# EAGLE design M507A (EAGLE 6.6.0)
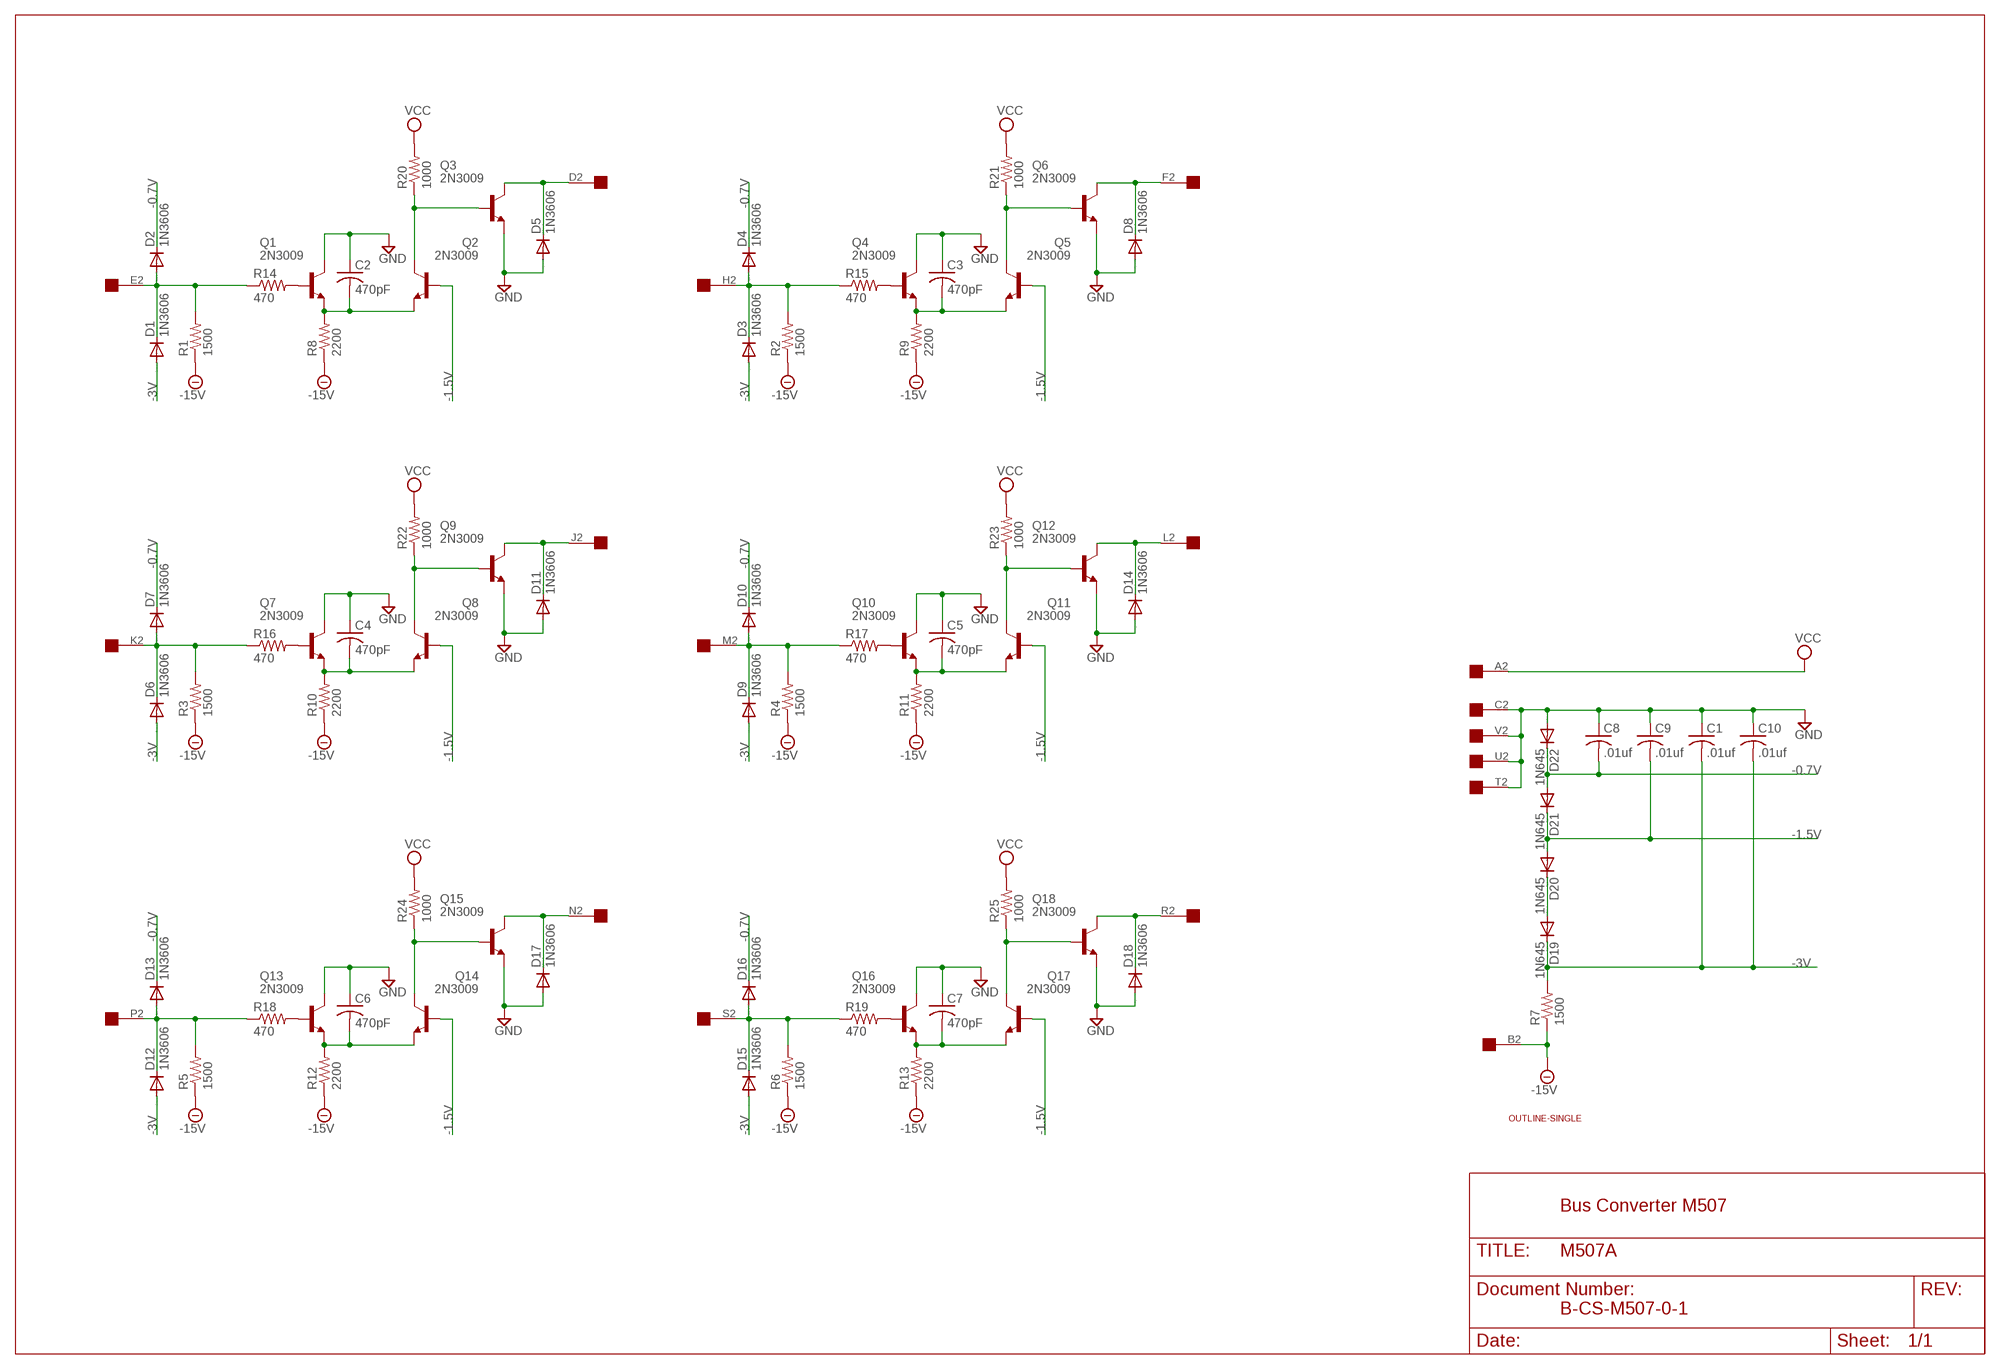
[diagram p0: schematic, sheet 1]

## Parts
C1  .01uf  C-US050-025X075  [C050-025X075]
C2  470pF  C-US050-025X075  [C050-025X075]
C3  470pF  C-US050-025X075  [C050-025X075]
C4  470pF  C-US050-025X075  [C050-025X075]
C5  470pF  C-US050-025X075  [C050-025X075]
C6  470pF  C-US050-025X075  [C050-025X075]
C7  470pF  C-US050-025X075  [C050-025X075]
C8  .01uf  C-US050-025X075  [C050-025X075]
C9  .01uf  C-US050-025X075  [C050-025X075]
C10  .01uf  C-US050-025X075  [C050-025X075]
D1  1N3606  1N4148DO35-10  [DO35-10]
D2  1N3606  1N4148DO35-10  [DO35-10]
D3  1N3606  1N4148DO35-10  [DO35-10]
D4  1N3606  1N4148DO35-10  [DO35-10]
D5  1N3606  1N4148DO35-10  [DO35-10]
D6  1N3606  1N4148DO35-10  [DO35-10]
D7  1N3606  1N4148DO35-10  [DO35-10]
D8  1N3606  1N4148DO35-10  [DO35-10]
D9  1N3606  1N4148DO35-10  [DO35-10]
D10  1N3606  1N4148DO35-10  [DO35-10]
D11  1N3606  1N4148DO35-10  [DO35-10]
D12  1N3606  1N4148DO35-10  [DO35-10]
D13  1N3606  1N4148DO35-10  [DO35-10]
D14  1N3606  1N4148DO35-10  [DO35-10]
D15  1N3606  1N4148DO35-10  [DO35-10]
D16  1N3606  1N4148DO35-10  [DO35-10]
D17  1N3606  1N4148DO35-10  [DO35-10]
D18  1N3606  1N4148DO35-10  [DO35-10]
D19  1N645  1N4148DO35-10  [DO35-10]
D20  1N645  1N4148DO35-10  [DO35-10]
D21  1N645  1N4148DO35-10  [DO35-10]
D22  1N645  1N4148DO35-10  [DO35-10]
Q1  2N3009  2N3019  [TO39]
Q2  2N3009  2N3019  [TO39]
Q3  2N3009  2N3019  [TO39]
Q4  2N3009  2N3019  [TO39]
Q5  2N3009  2N3019  [TO39]
Q6  2N3009  2N3019  [TO39]
Q7  2N3009  2N3019  [TO39]
Q8  2N3009  2N3019  [TO39]
Q9  2N3009  2N3019  [TO39]
Q10  2N3009  2N3019  [TO39]
Q11  2N3009  2N3019  [TO39]
Q12  2N3009  2N3019  [TO39]
Q13  2N3009  2N3019  [TO39]
Q14  2N3009  2N3019  [TO39]
Q15  2N3009  2N3019  [TO39]
Q16  2N3009  2N3019  [TO39]
Q17  2N3009  2N3019  [TO39]
Q18  2N3009  2N3019  [TO39]
R1  1500  R-US_0207/10  [0207/10]
R2  1500  R-US_0207/10  [0207/10]
R3  1500  R-US_0207/10  [0207/10]
R4  1500  R-US_0207/10  [0207/10]
R5  1500  R-US_0207/10  [0207/10]
R6  1500  R-US_0207/10  [0207/10]
R7  1500  R-US_0207/10  [0207/10]
R8  2200  R-US_0207/10  [0207/10]
R9  2200  R-US_0207/10  [0207/10]
R10  2200  R-US_0207/10  [0207/10]
R11  2200  R-US_0207/10  [0207/10]
R12  2200  R-US_0207/10  [0207/10]
R13  2200  R-US_0207/10  [0207/10]
R14  470  R-US_0207/10  [0207/10]
R15  470  R-US_0207/10  [0207/10]
R16  470  R-US_0207/10  [0207/10]
R17  470  R-US_0207/10  [0207/10]
R18  470  R-US_0207/10  [0207/10]
R19  470  R-US_0207/10  [0207/10]
R20  1000  R-US_0207/10  [0207/10]
R21  1000  R-US_0207/10  [0207/10]
R22  1000  R-US_0207/10  [0207/10]
R23  1000  R-US_0207/10  [0207/10]
R24  1000  R-US_0207/10  [0207/10]
R25  1000  R-US_0207/10  [0207/10]
U$3  EDGE-1  [EDGE-CON1]
U$4  OUTLINE-SINGLE  [SINGLE]

## Nets
-0.7V [Supply]: C8.2 D2.C D4.C D7.C D10.C D13.C D16.C D21.A D22.C
-1.5V [Supply]: C9.2 D20.A D21.C Q2.2(B) Q5.2(B) Q8.2(B) Q11.2(B) Q14.2(B) Q17.2(B)
-3V [Supply]: C1.2 C10.2 D1.A D3.A D6.A D9.A D12.A D15.A D19.C R7.2
-15V [Supply]: R1.1 R2.1 R3.1 R4.1 R5.1 R6.1 R7.1 R8.1 R9.1 R10.1 R11.1 R12.1 R13.1 U$3.B2
GND [Supply]: C1.1 C2.1 C3.1 C4.1 C5.1 C6.1 C7.1 C8.1 C9.1 C10.1 D5.A D8.A D11.A D14.A D17.A D18.A D22.A Q1.3(C) Q3.1(E) Q4.3(C) Q6.1(E) Q7.3(C) Q9.1(E) Q10.3(C) Q12.1(E) Q13.3(C) Q15.1(E) Q16.3(C) Q18.1(E) U$3.C2 U$3.T2 U$3.U2 U$3.V2
N$1: D1.C D2.A R1.2 R14.1 U$3.E2
N$2: Q1.2(B) R14.2
N$3: C2.2 Q1.1(E) Q2.1(E) R8.2
N$4: D3.C D4.A R2.2 R15.1 U$3.H2
N$5: Q2.3(C) Q3.2(B) R20.1
N$6: D5.C Q3.3(C) U$3.D2
N$7: Q4.2(B) R15.2
N$8: C3.2 Q4.1(E) Q5.1(E) R9.2
N$9: Q5.3(C) Q6.2(B) R21.1
N$10: D8.C Q6.3(C) U$3.F2
N$11: D6.C D7.A R3.2 R16.1 U$3.K2
N$12: Q7.2(B) R16.2
N$14: C4.2 Q7.1(E) Q8.1(E) R10.2
N$15: Q8.3(C) Q9.2(B) R22.1
N$16: D11.C Q9.3(C) U$3.J2
N$17: D9.C D10.A R4.2 R17.1 U$3.M2
N$18: Q10.2(B) R17.2
N$19: C5.2 Q10.1(E) Q11.1(E) R11.2
N$20: Q11.3(C) Q12.2(B) R23.1
N$21: D14.C Q12.3(C) U$3.L2
N$22: D12.C D13.A R5.2 R18.1 U$3.P2
N$23: Q13.2(B) R18.2
N$24: C6.2 Q13.1(E) Q14.1(E) R12.2
N$25: Q14.3(C) Q15.2(B) R24.1
N$26: D17.C Q15.3(C) U$3.N2
N$27: D15.C D16.A R6.2 R19.1 U$3.S2
N$28: Q16.2(B) R19.2
N$29: C7.2 Q16.1(E) Q17.1(E) R13.2
N$30: Q17.3(C) Q18.2(B) R25.1
N$31: D18.C Q18.3(C) U$3.R2
N$51 [Supply]: D19.A D20.C
VCC [Supply]: R20.2 R21.2 R22.2 R23.2 R24.2 R25.2 U$3.A2

## Notes on the sheet
- Bus Converter M507
- B-CS-M507-0-1

## Library data of the parts
C1-C10 = rcl:C-US: CAPACITOR, American symbol
D1-D22 = diode:1N4148: DIODE high speed (Philips)
Q1-Q18 = transistor-npn:2N3019: NPN Transistor
R1-R25 = rcl:R-US_: RESISTOR, American symbol
U$3 = dec-con:EDGE-1: Single-Sided DEC Edge Connector -- (side 2)
U$4 = dec-con:OUTLINE-*: Board outlines for DEC boards.

## Net classes
1 Supply: width 0.813 mm

## Board
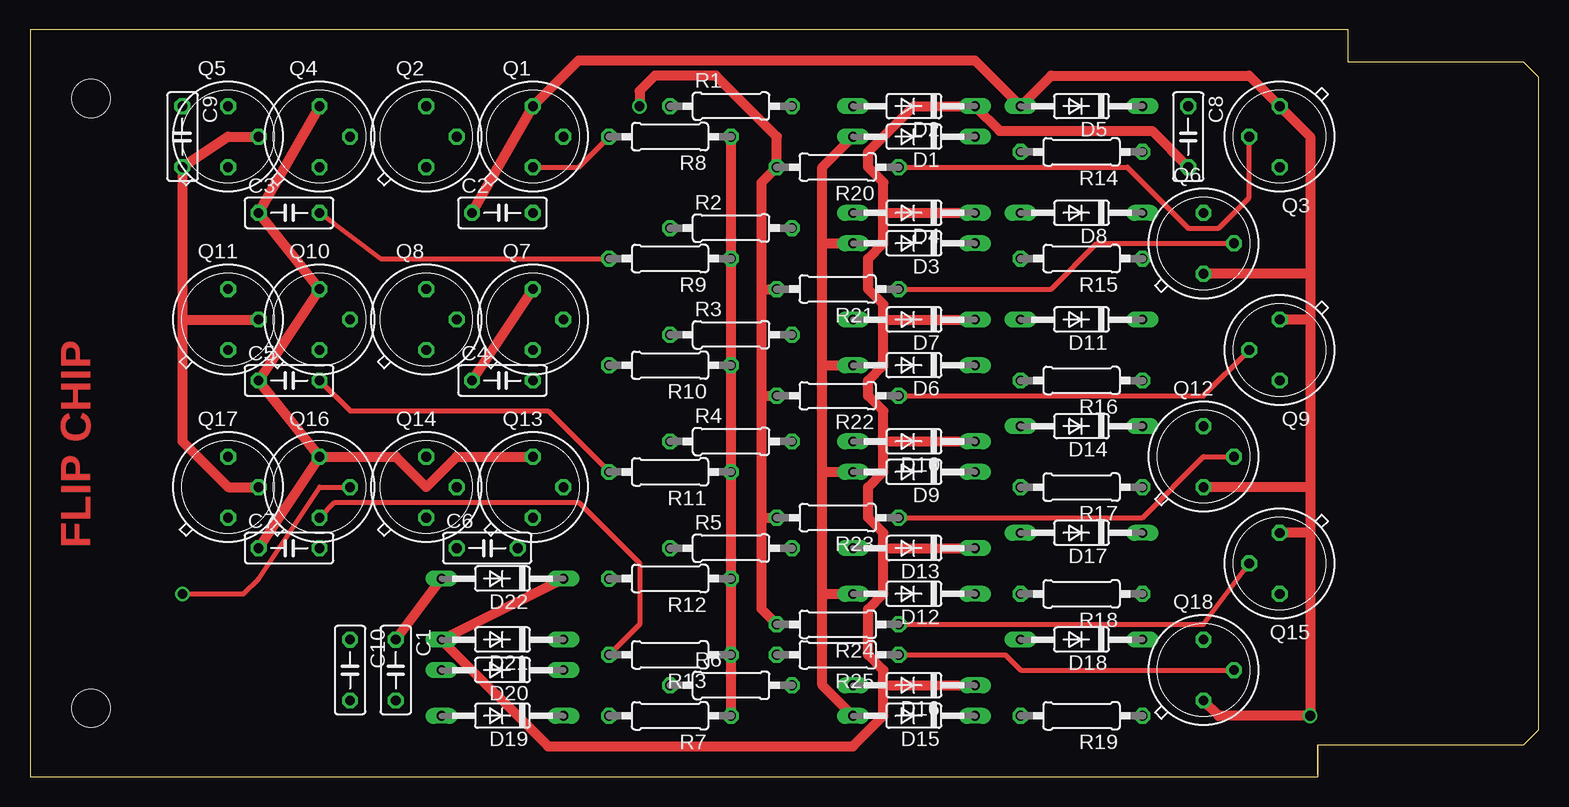
[diagram p1: board, top side]
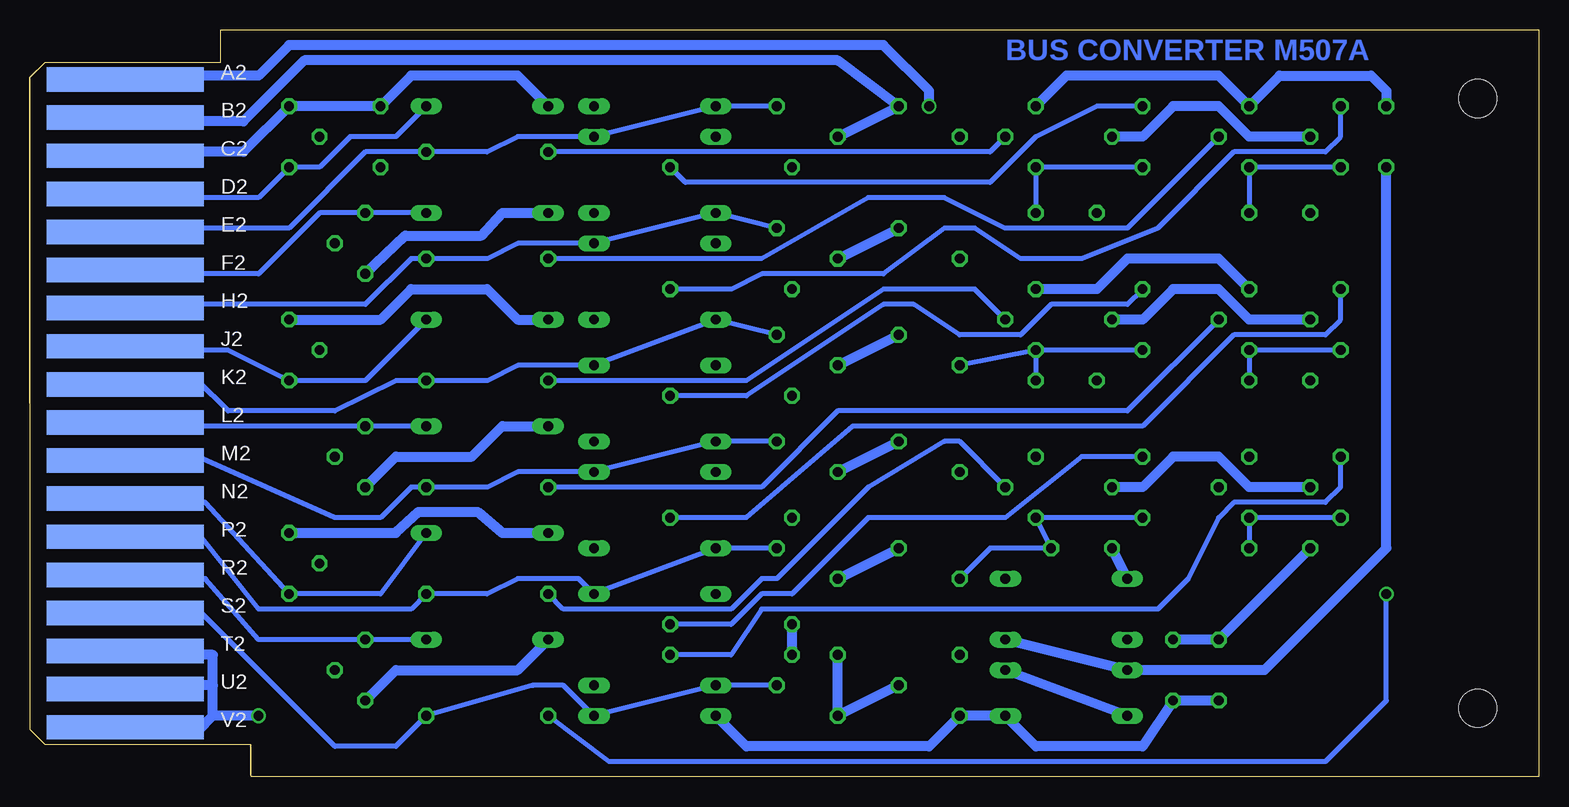
[diagram p2: board, bottom side, seen from below]

Size 125.73 x 62.23 mm. Coordinates in mm from the lower left corner, seen from the top.
Copper layers (1+16): Top 0.035mm / dielectric 1.5mm / Bottom 0.035mm
Design rules "16mils": minimum track width 16mil, minimum drill 32mil, track to track 15mil, track to pad 10mil, pad to pad 10mil, via to via 10mil, smd to smd 10mil, copper to edge 13mil, drill to drill 10mil, minimum pad ring 10mil, minimum via ring 8mil, stop-mask expansion 0mil, vias tented up to drill 0mil, thermal gap 10mil

### Footprints (pad centres in the part's own frame; a part is rotated, then mirrored left to right if it is on the bottom)
C050-025X075 = drill 0.813 octagon: 1 -2.54,0; 2 2.54,0
DO35-10 = drill 0.813 long: A 5.08,0; C -5.08,0
TO39 = drill 0.813 octagon: 1 0,-2.54; 2 2.54,0; 3 0,2.54
0207/10 = drill 0.813 octagon: 1 -5.08,0; 2 5.08,0
EDGE-CON1 = smd 13.106 x 2.032 bottom: A2 7.938,4.128; B2 7.938,7.303; C2 7.938,10.477; D2 7.938,13.652; E2 7.938,16.828; F2 7.938,20.003; H2 7.938,23.177; J2 7.938,26.352; K2 7.938,29.527; L2 7.938,32.703; M2 7.938,35.877; N2 7.938,39.053; P2 7.938,42.227; R2 7.938,45.403; S2 7.938,48.578; T2 7.938,51.752; U2 7.938,54.928; V2 7.938,58.102
SINGLE = hole 3.175: 120.65,56.515; 120.65,5.715

### Placement (x,y rotation side)
C1  30.48,8.89 270 top
C2  39.37,46.99 0 top
C3  21.59,46.99 0 top
C4  39.37,33.02 0 top
C5  21.59,33.02 0 top
C6  38.1,19.05 0 top
C7  21.59,19.05 0 top
C8  96.52,53.34 270 top
C9  12.7,53.34 270 top
C10  26.67,8.89 270 top
D1  73.66,53.34 180 top
D2  73.66,55.88 180 top
D3  73.66,44.45 180 top
D4  73.66,46.99 180 top
D5  87.63,55.88 180 top
D6  73.66,34.29 180 top
D7  73.66,38.1 180 top
D8  87.63,46.99 180 top
D9  73.66,25.4 180 top
D10  73.66,27.94 180 top
D11  87.63,38.1 180 top
D12  73.66,15.24 180 top
D13  73.66,19.05 180 top
D14  87.63,29.21 180 top
D15  73.66,5.08 180 top
D16  73.66,7.62 180 top
D17  87.63,20.32 180 top
D18  87.63,11.43 180 top
D19  39.37,5.08 180 top
D20  39.37,8.89 180 top
D21  39.37,11.43 180 top
D22  39.37,16.51 180 top
Q1  41.91,53.34 0 top
Q2  33.02,53.34 0 top
Q3  104.14,53.34 180 top
Q4  24.13,53.34 0 top
Q5  16.51,53.34 0 top
Q6  97.79,44.45 0 top
Q7  41.91,38.1 0 top
Q8  33.02,38.1 0 top
Q9  104.14,35.56 180 top
Q10  24.13,38.1 0 top
Q11  16.51,38.1 0 top
Q12  97.79,26.67 0 top
Q13  41.91,24.13 0 top
Q14  33.02,24.13 0 top
Q15  104.14,17.78 180 top
Q16  24.13,24.13 0 top
Q17  16.51,24.13 0 top
Q18  97.79,8.89 0 top
R1  58.42,55.88 0 top
R2  58.42,45.72 0 top
R3  58.42,36.83 0 top
R4  58.42,27.94 0 top
R5  58.42,19.05 0 top
R6  58.42,7.62 0 top
R7  53.34,5.08 180 top
R8  53.34,53.34 180 top
R9  53.34,43.18 180 top
R10  53.34,34.29 180 top
R11  53.34,25.4 180 top
R12  53.34,16.51 180 top
R13  53.34,10.16 180 top
R14  87.63,52.07 180 top
R15  87.63,43.18 180 top
R16  87.63,33.02 180 top
R17  87.63,24.13 180 top
R18  87.63,15.24 180 top
R19  87.63,5.08 180 top
R20  67.31,50.8 180 top
R21  67.31,40.64 180 top
R22  67.31,31.75 180 top
R23  67.31,21.59 180 top
R24  67.31,12.7 180 top
R25  67.31,10.16 180 top
U$1  [FLIPCHIP]  0,0 0 top
U$3  125.73,62.23 180 top
U$4  125.73,62.23 180 top

### Tracks (layer width: path | path; a pad name or v marks a point on that pad's centre or on a via)
-0.7V
  Top 0.813: D22.C D21.A 43.18,2.54 68.58,2.54 71.12,5.08 71.12,7.62 | 71.12,7.62 71.12,8.89 69.85,10.16 69.85,13.97 71.12,15.24 71.12,19.05 | 71.12,19.05 71.12,20.32 69.85,21.59 69.85,24.13 71.12,25.4 71.12,27.94 | 71.12,27.94 71.12,30.48 69.85,31.75 69.85,33.02 71.12,34.29 71.12,38.1 | 71.12,38.1 71.12,39.37 69.85,40.64 69.85,43.18 71.12,44.45 71.12,46.99 | 71.12,46.99 71.12,49.53 69.85,50.8 69.85,52.07 73.66,55.88 D2.C 80.8,53.82 93.5,53.82 C8.2 | 71.12,7.62 D16.C | 71.12,19.05 D13.C | 71.12,27.94 D10.C | 71.12,38.1 D7.C | 71.12,46.99 D4.C
-1.5V
  Top 0.813: Q5.2 16.51,53.34 C9.2 12.7,38.1 | Q17.2 16.51,24.13 12.7,27.94 12.7,38.1 | 12.7,38.1 Q11.2
  Bottom 0.813: C9.2 12.7,19.05 22.86,8.89 D20.A D21.C | Q2.2 33.02,53.34 30.48,55.88 26.67,55.88 24.13,53.34 Q5.2 | Q8.2 33.02,38.1 30.48,40.64 26.67,40.64 24.13,38.1 Q11.2 | Q14.2 33.02,24.13 30.48,26.67 26.67,26.67 24.13,24.13 Q17.2
-3V
  Top 0.813: D1.A 66.04,50.8 66.04,44.45 | 66.04,15.24 66.04,7.62 D15.A | 66.04,15.24 66.04,25.4 | 66.04,25.4 66.04,34.29 | 66.04,34.29 66.04,44.45 | 66.04,15.24 D12.A | 66.04,25.4 D9.A | 66.04,34.29 D6.A | 66.04,44.45 D3.A
  Bottom 0.813: C10.2 C1.2 33.02,2.54 41.91,2.54 D19.C R7.2 50.8,2.54 66.04,2.54 D15.A
-15V
  Top 0.813: R7.1 R13.1 R12.1 R11.1 R10.1 R9.1 R8.1
  Bottom 0.813: U$3.B2 116.84,54.61 107.95,54.61 102.87,59.69 58.42,59.69 R1.1 R8.1 | R9.1 R2.1 | R10.1 R3.1 | R11.1 R4.1 | R12.1 R5.1 | R13.1 R7.1 R6.1
GND  (via drill 0.81)
  Top 0.813: C7.1 Q16.3 | Q16.3 C5.1 Q10.3 C3.1 Q4.3 | Q7.3 C4.1 | C2.1 Q1.3 45.72,59.69 78.74,59.69 D5.A 85.09,58.42 101.6,58.42 Q3.1 106.68,53.34 106.68,41.91 | 106.68,41.91 106.68,38.1 | 106.68,38.1 106.68,24.13 | 106.68,24.13 106.68,20.32 | 106.68,20.32 v106.68,5.08 99.06,5.08 Q18.1 | 106.68,20.32 Q15.1 | 106.68,38.1 Q9.1 | 106.68,24.13 Q12.1 | 106.68,41.91 Q6.1 | C1.1 D22.A | Q13.3 35.56,26.67 33.02,24.13 30.48,26.67 Q16.3
  Bottom 0.813: C9.1 12.7,57.15 13.97,58.42 21.59,58.42 Q4.3 26.67,58.42 39.37,58.42 Q1.3 | U$3.V2 116.84,3.81 111.76,3.81 110.49,5.08 | 110.49,5.08 110.49,7.62 | 110.49,7.62 110.49,10.16 116.84,10.16 U$3.T2 | U$3.U2 116.84,7.62 110.49,7.62 | v106.68,5.08 110.49,5.08 | U$3.C2 116.84,52.07 107.95,52.07 Q3.1 C8.1 93.98,58.42 85.09,58.42 D5.A | D8.A 86.36,46.99 88.11,45.09 94.46,45.09 Q6.1 | D11.A 85.09,38.1 87.63,40.64 93.98,40.64 96.52,38.1 Q9.1 | D14.A 86.36,29.21 88.9,26.67 95.25,26.67 Q12.1 | D17.A 86.36,20.32 88.42,22.07 93.34,22.07 95.25,20.32 Q15.1 | D18.A 85.09,8.89 95.25,8.89 Q18.1 | C1.1 C10.1 C7.1 | D22.A C6.1 | Q10.3 26.67,43.18 34.29,43.18 36.83,40.64 Q7.3
N$1
  Bottom 0.406: U$3.E2 117.17,45.39 116.84,45.72 104.14,45.72 97.79,52.07 R14.1 87.63,52.07 85.09,53.34 D1.C D2.A R1.2
N$2
  Bottom 0.406: Q1.2 45.72,52.07 R14.2
N$3
  Top 0.406: R8.2 45.72,50.8 Q1.1
  Bottom 0.406: Q2.1 Q1.1 C2.2
N$4
  Bottom 0.406: R2.2 D4.A D3.C 85.09,44.45 87.63,43.18 R15.1 93.98,43.18 97.79,39.37 116.84,39.37 U$3.H2
N$5
  Top 0.406: R20.1 91.44,50.8 96.52,45.72 99.06,45.72 101.6,48.26 Q3.2
  Bottom 0.406: Q2.3 36.83,55.88 41.91,53.34 45.72,49.53 71.12,49.53 R20.1
N$6
  Bottom 0.406: U$3.D2 116.84,48.26 106.68,48.26 Q3.3 101.6,50.8 99.06,53.34 95.25,53.34 D5.C
N$7
  Bottom 0.406: Q4.2 34.29,45.72 44.45,45.72 49.53,48.26 55.88,48.26 64.77,43.18 R15.2
N$8
  Top 0.406: R9.2 29.21,43.18 C3.2
  Bottom 0.406: Q5.1 Q4.1 C3.2
N$9
  Top 0.406: Q6.2 88.9,44.45 85.09,40.64 R21.1
  Bottom 0.406: Q5.3 16.51,53.34 17.78,52.07 25.4,52.07 31.75,45.72 38.1,43.18 43.18,43.18 46.99,45.72 49.53,45.72 54.61,41.91 64.77,41.91 67.31,40.64 R21.1
N$10
  Bottom 0.406: U$3.F2 117.12,42.19 116.84,41.91 106.68,41.91 101.6,46.99 Q6.3 D8.C
N$11
  Bottom 0.406: R3.2 D7.A D6.C 85.09,34.29 87.63,33.02 R16.1 95.25,33.02 100.33,30.48 109.22,30.48 111.76,33.02 116.84,33.02 U$3.K2
N$12
  Bottom 0.406: Q7.2 46.99,40.64 54.61,40.64 66.04,33.02 R16.2
N$14
  Bottom 0.406: Q8.1 Q7.1 | Q7.1 C4.2 | Q7.1 R10.2
N$15
  Top 0.406: R22.1 97.79,31.75 Q9.2
  Bottom 0.406: Q8.3 34.29,39.37 40.64,39.37 43.18,36.83 48.26,36.83 52.07,39.37 54.61,39.37 66.04,31.75 R22.1
N$16
  Bottom 0.406: D11.C 97.79,33.02 Q9.3 109.22,35.56 116.84,35.56 U$3.J2
N$17
  Bottom 0.406: R4.2 D10.A D9.C 85.09,25.4 87.63,24.13 R17.1 93.98,24.13 96.52,21.59 100.33,21.59 111.76,26.67 116.84,26.67 U$3.M2
N$18
  Bottom 0.406: Q10.2 34.29,30.48 58.42,30.48 64.77,24.13 R17.2
N$19
  Top 0.406: C5.2 26.67,30.48 43.18,30.48 R11.2
  Bottom 0.406: Q11.1 Q10.1 C5.2
N$20
  Top 0.406: R23.1 92.71,21.59 97.79,26.67 Q12.2
  Bottom 0.406: Q11.3 16.51,38.1 17.78,36.83 25.4,36.83 33.02,29.21 57.15,29.21 66.04,21.59 R23.1
N$21
  Bottom 0.406: U$3.L2 116.84,29.21 Q12.3 D14.C
N$22
  Bottom 0.406: R5.2 D13.A D12.C 80.01,16.51 85.09,16.51 87.63,15.24 R18.1 93.98,13.97 106.68,13.97 111.76,20.32 116.84,20.32 U$3.P2
N$23
  Bottom 0.406: Q13.2 48.26,27.94 49.53,27.94 55.88,24.13 63.5,16.51 64.77,16.51 67.31,13.97 81.28,13.97 R18.2
N$24
  Bottom 0.406: Q14.1 Q13.1 C6.2 45.72,19.05 R12.2
N$25
  Top 0.406: R24.1 97.79,12.7 Q15.2
  Bottom 0.406: Q14.3 38.1,26.67 44.45,21.59 55.88,21.59 62.23,15.24 64.77,15.24 67.31,12.7 R24.1
N$26
  Bottom 0.406: D17.C 96.52,15.24 Q15.3 111.12,22.86 118.11,22.86 U$3.N2
N$27
  Bottom 0.406: U$3.S2 117.14,13.66 116.84,13.97 111.76,13.97 100.33,2.54 95.25,2.54 R19.1 83.82,7.62 81.28,7.62 D15.C D16.A R6.2
N$28  (via drill 0.81)
  Top 0.406: v12.7,15.24 17.78,15.24 19.05,16.51 24.13,24.13 Q16.2
  Bottom 0.406: R19.2 77.47,1.27 17.78,1.27 12.7,6.35 v12.7,15.24
N$29
  Top 0.406: Q16.1 25.4,22.86 45.72,22.86 50.8,17.78 50.8,12.7 R13.2
  Bottom 0.406: Q17.1 Q16.1 C7.2
N$30
  Top 0.406: R25.1 81.28,10.16 82.55,8.89 Q18.2
  Bottom 0.406: Q17.3 16.51,24.13 17.78,22.86 25.4,22.86 26.67,21.59 29.21,16.51 31.75,13.97 64.77,13.97 67.31,10.16 R25.1
N$31
  Bottom 0.406: D18.C Q18.3 106.68,11.43 111.12,16.51 116.84,16.51 U$3.R2
N$51
  Bottom 0.813: D19.A D20.C
VCC  (via drill 0.81)
  Top 0.813: v50.8,55.88 50.8,57.15 52.07,58.42 57.15,58.42 62.23,53.34 R20.2 60.96,49.53 60.96,40.64 | 60.96,21.59 60.96,13.97 R24.2 | 60.96,21.59 60.96,31.75 | 60.96,31.75 60.96,40.64 | 60.96,21.59 R23.2 | 60.96,31.75 R22.2 | 60.96,40.64 R21.2
  Bottom 0.813: U$3.A2 117.22,58.04 116.84,58.42 106.68,58.42 104.14,60.96 54.61,60.96 50.8,57.15 v50.8,55.88 | R25.2 R24.2

### Text on the board
Bottom: BUS CONVERTER M507A